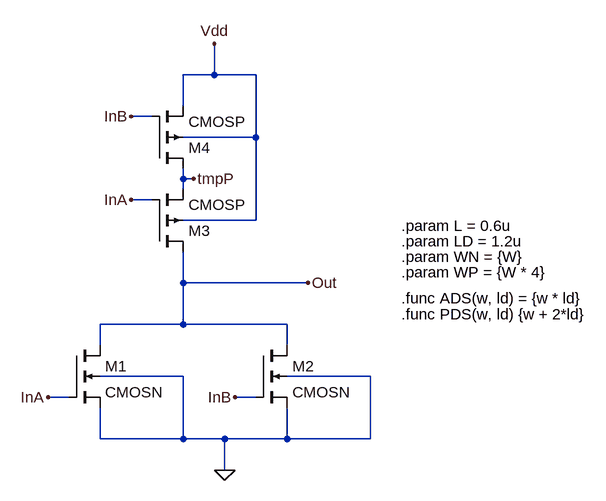
[diagram p0: schematic nor.asc]
nor.asc, the LTspice schematic file:
Version 4
SHEET 1 1844 680
WIRE 592 -112 592 -160
WIRE 592 -112 544 -112
WIRE 656 -112 592 -112
WIRE 544 -64 544 -112
WIRE 496 -48 464 -48
WIRE 656 -16 656 -112
WIRE 656 -16 544 -16
WIRE 544 48 544 32
WIRE 560 48 544 48
WIRE 544 64 544 48
WIRE 496 80 464 80
WIRE 656 112 656 -16
WIRE 656 112 544 112
WIRE 544 208 544 160
WIRE 736 208 544 208
WIRE 544 272 544 208
WIRE 544 272 416 272
WIRE 704 272 544 272
WIRE 416 304 416 272
WIRE 704 304 704 272
WIRE 544 352 416 352
WIRE 832 352 704 352
WIRE 368 384 336 384
WIRE 656 384 624 384
WIRE 416 448 416 400
WIRE 544 448 544 352
WIRE 544 448 416 448
WIRE 608 448 544 448
WIRE 704 448 704 400
WIRE 704 448 608 448
WIRE 832 448 832 352
WIRE 832 448 704 448
WIRE 608 496 608 448
FLAG 624 384 InB
FLAG 736 208 Out
FLAG 336 384 InA
FLAG 464 80 InA
FLAG 464 -48 InB
FLAG 592 -160 Vdd
FLAG 608 496 0
FLAG 560 48 tmpP
SYMBOL nmos4 656 304 R0
SYMATTR InstName M2
SYMATTR Value CMOSN
SYMATTR Value2 l={L} w={WN} ad={ADS(WN, LD)} as={ADS(WN, LD)} pd={PDS(WN, LD)} ps={PDS(WN, LD)}
SYMBOL pmos4 496 160 M180
SYMATTR InstName M3
SYMATTR Value CMOSP
SYMATTR Value2 l={L} w={WP} ad={ADS(WP, LD)} as={ADS(WP, LD)} pd={PDS(WP, LD)} ps={PDS(WP, LD)}
SYMBOL nmos4 368 304 R0
SYMATTR InstName M1
SYMATTR Value CMOSN
SYMATTR Value2 l={L} w={WN} ad={ADS(WN, LD)} as={ADS(WN, LD)} pd={PDS(WN, LD)} ps={PDS(WN, LD)}
SYMBOL pmos4 496 32 M180
SYMATTR InstName M4
SYMATTR Value CMOSP
SYMATTR Value2 l={L} w={WP} ad={ADS(WP, LD)} as={ADS(WP, LD)} pd={PDS(WP, LD)} ps={PDS(WP, LD)}
TEXT 880 232 Left 2 !.func ADS(w, ld) = {w * ld}
TEXT 880 256 Left 2 !.func PDS(w, ld) {w + 2*ld}
TEXT 880 144 Left 2 !.param LD = 1.2u
TEXT 880 168 Left 2 !.param WN = {W}
TEXT 880 120 Left 2 !.param L = 0.6u
TEXT 880 192 Left 2 !.param WP = {W * 4}

The netlist it stands for:
* nor.asc
M2 Out InB 0 0 CMOSN l={L} w={WN} ad={ADS(WN, LD)} as={ADS(WN, LD)} pd={PDS(WN, LD)} ps={PDS(WN, LD)}
M3 Out InA tmpP Vdd CMOSP l={L} w={WP} ad={ADS(WP, LD)} as={ADS(WP, LD)} pd={PDS(WP, LD)} ps={PDS(WP, LD)}
M1 Out InA 0 0 CMOSN l={L} w={WN} ad={ADS(WN, LD)} as={ADS(WN, LD)} pd={PDS(WN, LD)} ps={PDS(WN, LD)}
M4 tmpP InB Vdd Vdd CMOSP l={L} w={WP} ad={ADS(WP, LD)} as={ADS(WP, LD)} pd={PDS(WP, LD)} ps={PDS(WP, LD)}
.model NMOS NMOS
.model PMOS PMOS
.lib standard.mos
.func ADS(w, ld) = {w * ld}
.func PDS(w, ld) {w + 2*ld}
.param LD = 1.2u
.param WN = {W}
.param L = 0.6u
.param WP = {W * 4}
.backanno
.end